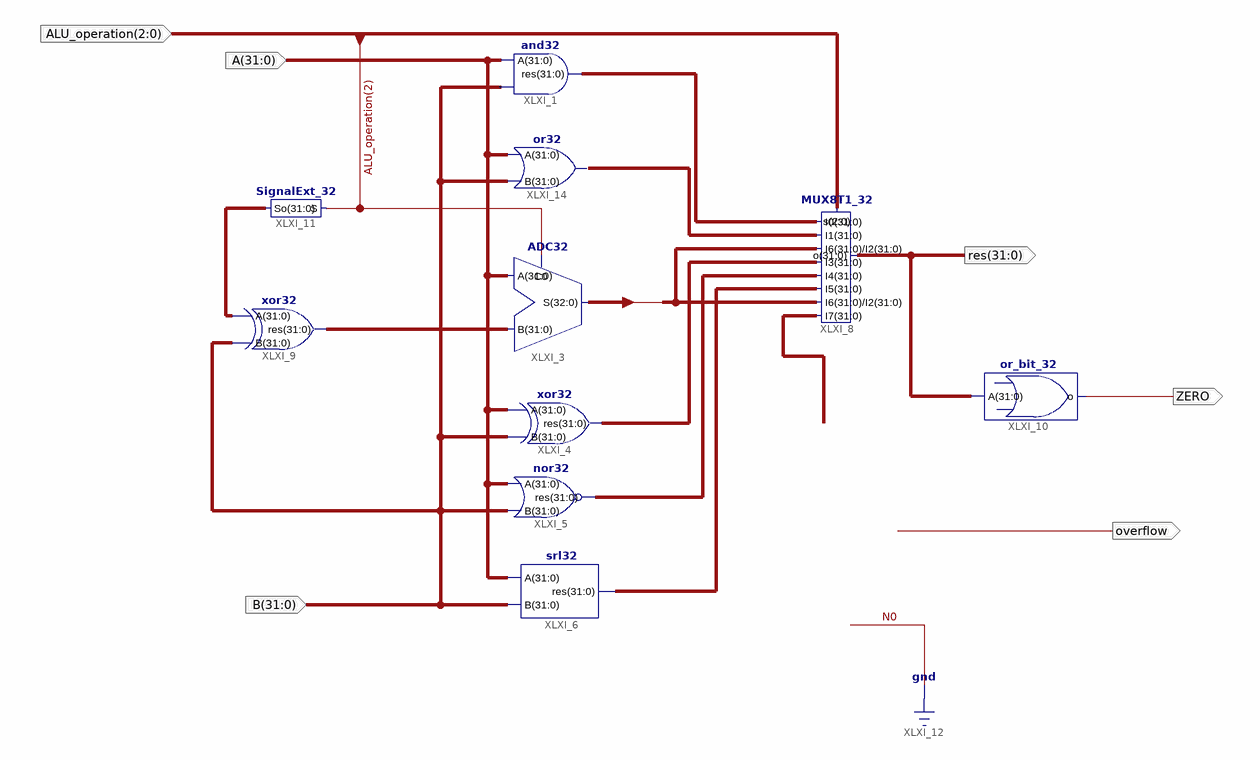
[diagram p0: schematic sheet 1]
// Xilinx ISE schematic ALU.sch (kintex7) as structural Verilog: 10 symbols, 6 ports
module ALU (
  input  [2:0] ALU_operation,
  input  [31:0] B,
  input  [31:0] A,
  output [31:0] res,
  output ZERO,
  output overflow
);

  wire [31:0] XLXN_4, XLXN_7, XLXN_8, XLXN_9, XLXN_23, XLXN_24, XLXN_37;
  wire [32:0] S;

  and32 XLXI_1 (.res(XLXN_4), .A(A), .B(B));
  ADC32 XLXI_3 (.B(XLXN_23), .A(A), .C0(ALU_operation[2]), .S(S));
  xor32 XLXI_4 (.A(A), .B(B), .res(XLXN_9));
  nor32 XLXI_5 (.res(XLXN_8), .A(A), .B(B));
  srl32 XLXI_6 (.A(A), .B(B), .res(XLXN_7));
  MUX8T1_32 XLXI_8 (
    .s(ALU_operation), .I7({{31{1'b0}}, S[32]}), .I6(S[31:0]), .I5(XLXN_7), .I4(XLXN_8), .I3(XLXN_9),
    .I2(S[31:0]), .I1(XLXN_37), .I0(XLXN_4), .o(res));
  xor32 XLXI_9 (.A(XLXN_24), .B(B), .res(XLXN_23));
  or_bit_32 XLXI_10 (.o(ZERO), .A(res));
  SignalExt_32 XLXI_11 (.So(XLXN_24), .S(ALU_operation[2]));
  or32 XLXI_14 (.res(XLXN_37), .A(A), .B(B));
endmodule
